# EAGLE design 30w developer board (EAGLE 5.07)
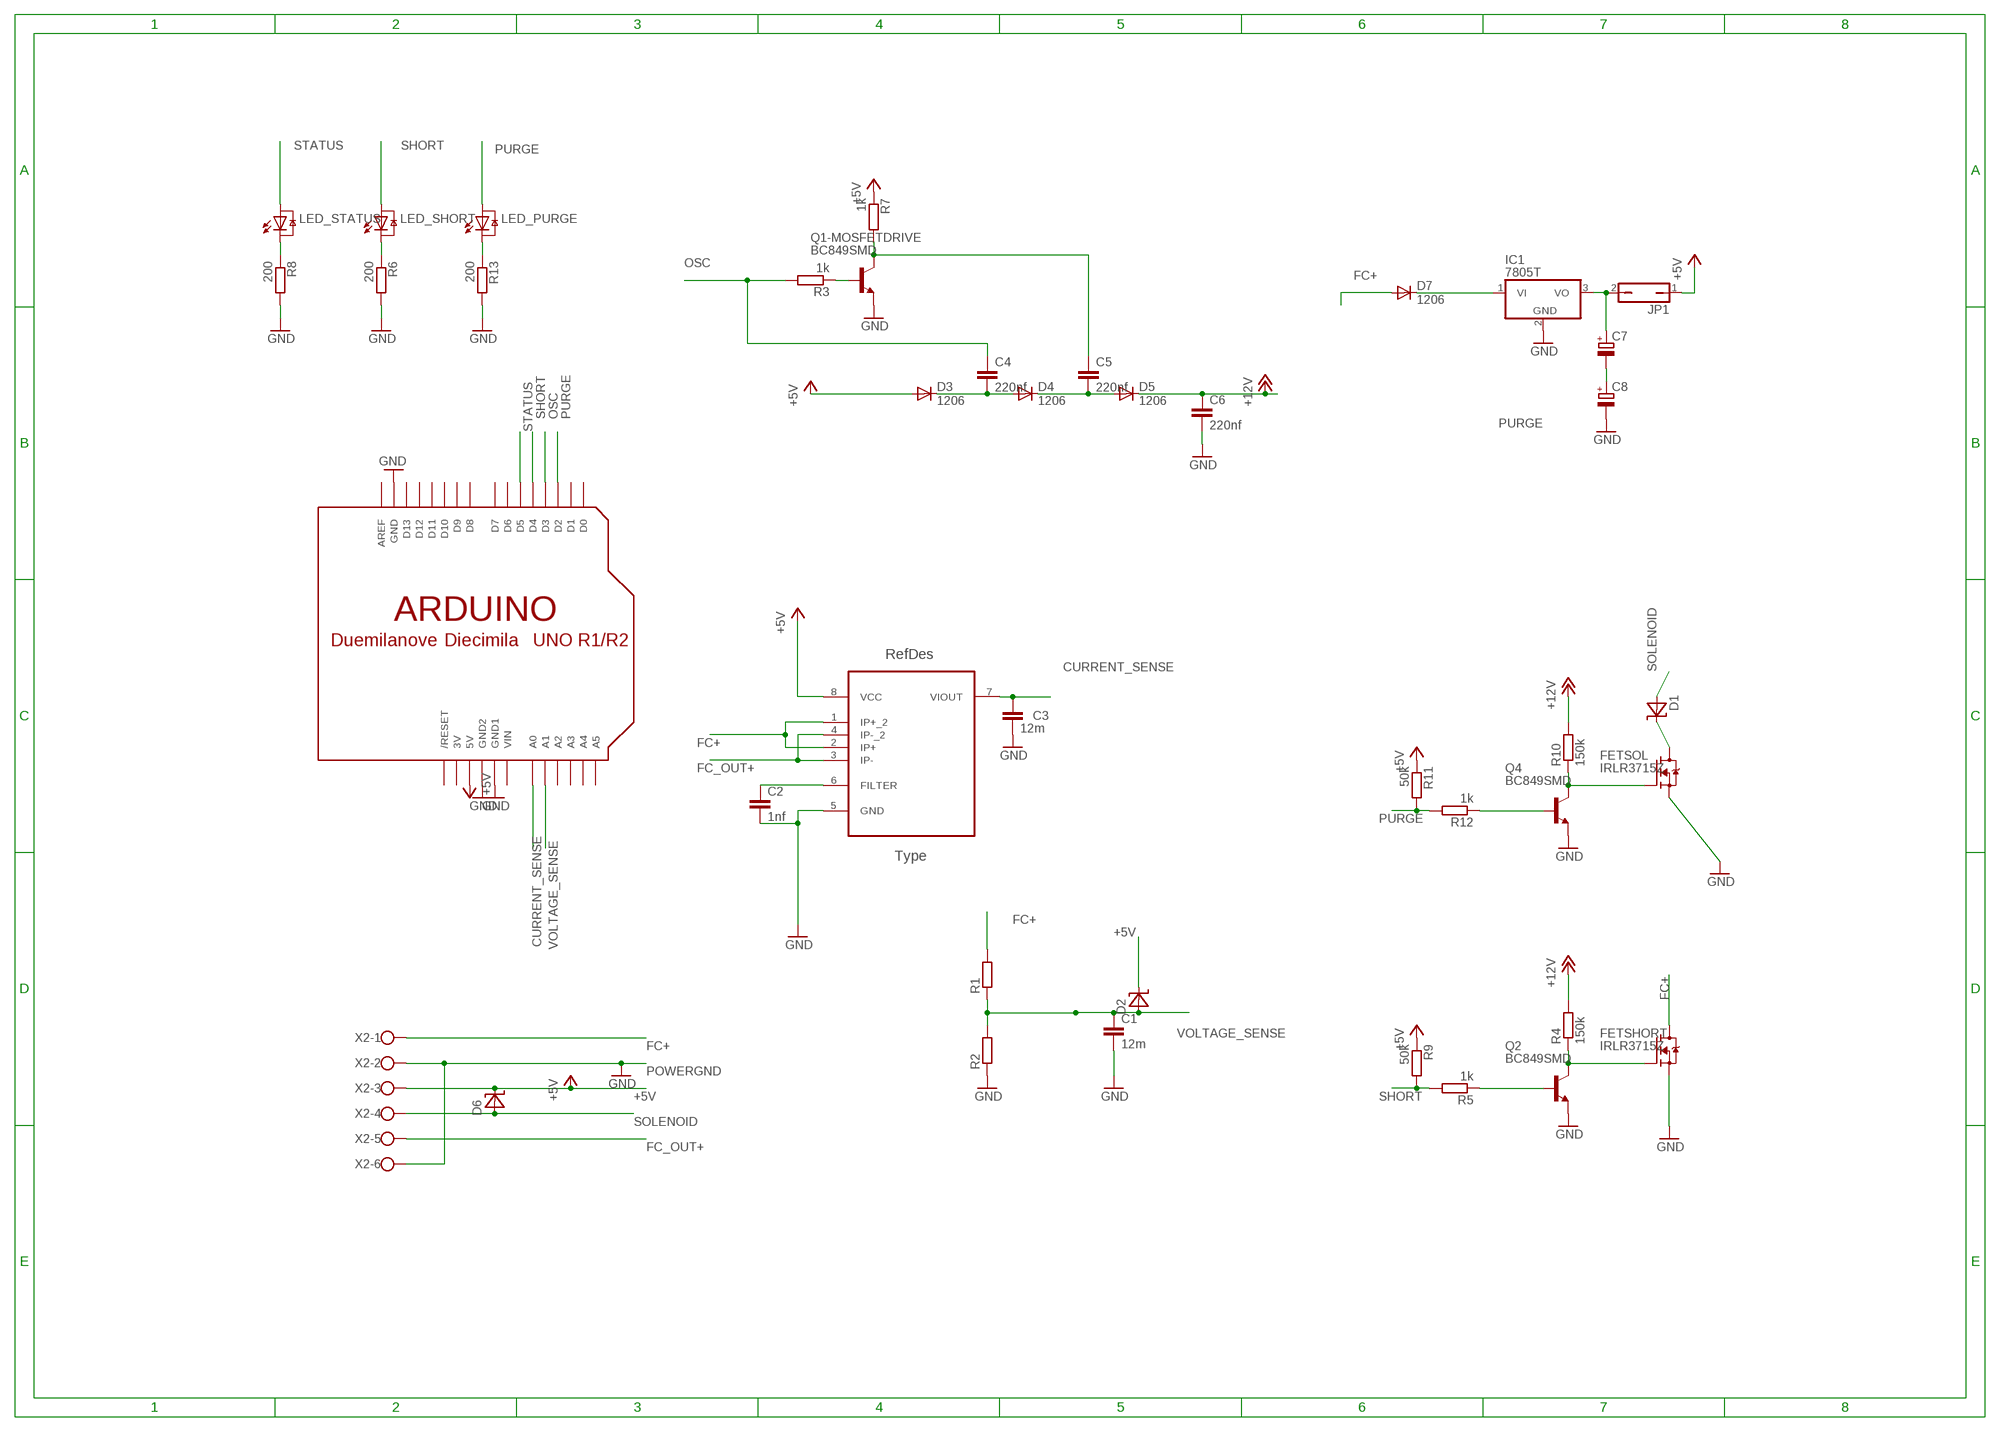
[diagram p0: schematic, sheet 1]

## Parts
C1  12m  C-EUC1206  [C1206]
C2  1nf  C-EUC1206  [C1206]
C3  12m  C-EUC1206  [C1206]
C4  220nf  C-EUC1206  [C1206]
C5  220nf  C-EUC1206  [C1206]
C6  220nf  C-EUC1206  [C1206]
C7  CPOL-EUE5-10.5  [E5-10,5]
C8  CPOL-EUE5-10.5  [E5-10,5]
D1  1206ZENER  [C1206]
D2  1206ZENER  [C1206]
D3  1206  [C1206]
D4  1206  [C1206]
D5  1206  [C1206]
D6  1206ZENER  [C1206]
D7  1206  [C1206]
FETSHORT  IRLR3715Z  [TO252]
FETSOL  IRLR3715Z  [TO252]
IC1  7805T  [TO220H]
JP1  JP1Q  [JP1]
LED_PURGE  GM5BW96385A  [GM5BW96385A]
LED_SHORT  GM5BW96385A  [GM5BW96385A]
LED_STATUS  GM5BW96385A  [GM5BW96385A]
Q1-MOSFETDRIVE  BC849SMD  [SOT23-BEC]
Q2  BC849SMD  [SOT23-BEC]
Q4  BC849SMD  [SOT23-BEC]
R1  R-EU_R1206  [R1206]
R2  R-EU_R1206  [R1206]
R3  1k  R-EU_M1206  [M1206]
R4  150k  R-EU_M1206  [M1206]
R5  1k  R-EU_M1206  [M1206]
R6  200  R-EU_M1206  [M1206]
R7  1k  R-EU_M1206  [M1206]
R8  200  R-EU_M1206  [M1206]
R9  50k  R-EU_M1206  [M1206]
R10  150k  R-EU_M1206  [M1206]
R11  50k  R-EU_M1206  [M1206]
R12  1k  R-EU_M1206  [M1206]
R13  200  R-EU_M1206  [M1206]
U1  ACS712ELCTR-05B-T  [SOIC127P600X175-8N]
U$1  ARDUINO-BPLACE  [ARDUINO-BPLACE]
X2  W237-6  [W237-6]

## Nets
+5V [medpower]: D2.CATHODE(C) D3.ANODE(A) D6.CATHODE(C) JP1.1 R7.1 R9.1 R11.1 U1.8(VCC) U$1.5V X2.3
+12V: C6.1 D5.CATHODE(C) R4.2 R10.2
CURRENT_SENSE: C3.1 U1.7(VIOUT) U$1.A0
FC+ [power]: D7.ANODE(A) FETSHORT.3(D) R1.2 U1.1(IP+_2) U1.2(IP+) X2.1
FC_OUT+ [power]: U1.3(IP-) U1.4(IP-_2) X2.5
GND [medpower]: C1.2 C2.2 C3.2 C6.2 C8.- IC1.2(GND) Q1-MOSFETDRIVE.E Q2.E Q4.E R2.1 R6.2 R8.2 R13.2 U1.5(GND) U$1.GND U$1.GND1 U$1.GND2
N$1: C7.+ IC1.3(VO) JP1.2
N$2: C7.- C8.+
N$3: FETSHORT.1(G) Q2.C R4.1
N$4: FETSOL.1(G) Q4.C R10.1
N$5: C2.1 U1.6(FILTER)
N$6: C4.2 D3.CATHODE(C) D4.ANODE(A)
N$7: C5.2 D4.CATHODE(C) D5.ANODE(A)
N$8: Q4.B R12.1
N$9: D7.CATHODE(C) IC1.1(VI)
N$10 [medpower]: D1.CATHODE(C) FETSOL.3(D)
N$11: C5.1 Q1-MOSFETDRIVE.C R7.2
N$12: Q1-MOSFETDRIVE.B R3.1
N$13: LED_SHORT.C R6.1
N$14: Q2.B R5.1
N$15: LED_PURGE.C R13.1
N$16: LED_STATUS.C R8.1
OSC: C4.1 R3.2 U$1.D3
POWERGND [power]: FETSHORT.2(S) FETSOL.2(S) X2.2 X2.6 ; supply symbol labelled GND
PURGE: LED_PURGE.A R11.2 R12.2 U$1.D2
SHORT: LED_SHORT.A R5.2 R9.2 U$1.D4
SOLENOID [medpower]: D1.ANODE(A) D6.ANODE(A) X2.4
STATUS: LED_STATUS.A U$1.D5
VOLTAGE_SENSE: C1.1 D2.ANODE(A) R1.1 R2.2 U$1.A1
Unconnected: U$1.A2 U$1.A3 U$1.A4 U$1.A5 U$1.AREF U$1.D0 U$1.D1 U$1.D6 U$1.D7 U$1.D8 U$1.D9 U$1.D10 U$1.D11 U$1.D12 U$1.D13 U$1.RESET(/RESET)

## Power pins joined to a net without a drawn wire
3V: U$1.3V
VIN: U$1.VIN

## Library data of the parts
C1-C3 = matt rcl:C-EU: CAPACITOR, European symbol
C4-C6 = resistor:C-EU: CAPACITOR, European symbol
C7 C8 = matt rcl:CPOL-EU: POLARIZED CAPACITOR, European symbol
D1 D2 D6 = matt diode:1206ZENER
D3-D5 D7 = matt diode:1206
FETSHORT FETSOL = matt transistor-fet:IRLR3715Z
IC1 = linear:78*: Positive VOLTAGE REGULATOR Source: http://cache.national.com/ds/LM/LM78L05.pdf http://www.fairchildsemi.com/ds/LM/LM7805.pdf
JP1 = jumper:JP1Q: JUMPER
LED_PURGE LED_SHORT LED_STATUS = matt led:GM5BW96385A: High brightness White Color LED 2300 mcd @ IF = 20mA achieved via InGaN Blue LED chip in combination with Yellow Phosphor Source: http://document.sharpsma.com/files/GM5BW96385A.pdf
Q1-MOSFETDRIVE Q2 Q4 = matt transistor-npn:BC849*: NPN Transistor
R1 R2 = matt rcl:R-EU_: RESISTOR, European symbol
R3-R13 = resistor:R-EU_: RESISTOR, European symbol
U1 = matt-allegro:ACS712ELCTR-05B-T: Linear Current Sensor; DESCRIPTION: Linear Current Sensor; MPN: ACS712ELCTR-05B-T; OC_FARNELL: 27M3644; OC_NEWARK: 1329623; PACKAGE: SOIC-8; SUPPLIER: Allegro
U$1 = adafruit:ARDUINO: Arduino Diecimila/Duemilanove Make a shield with ease, this package has all the named pins as well as the two mounting drill holes and an outline of the USB and DC power connector. The outline is on the DIMENSION layer, so if your board house uses it they will cut the outline to match. http://www.ladyada.net/library/pcb/eaglelibrary.html
X2 = con-wago-500:W237-6: WAGO SCREW CLAMP

## Net classes
1 power: width 3 mm
2 medpower: width 1 mm

## Board
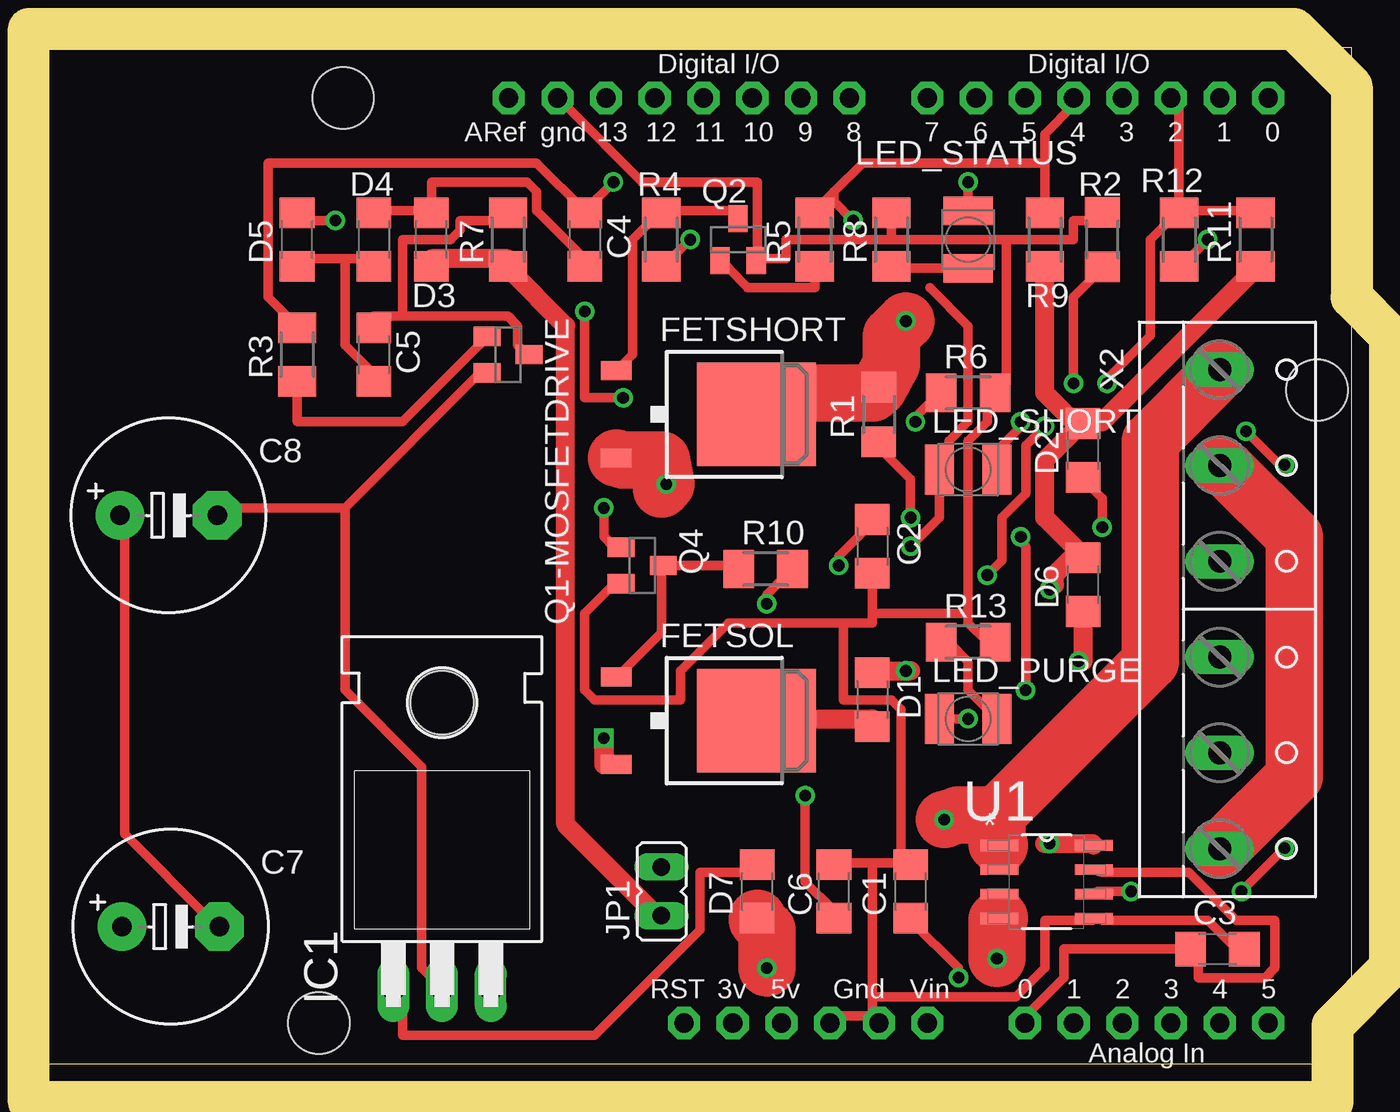
[diagram p1: board, top side]
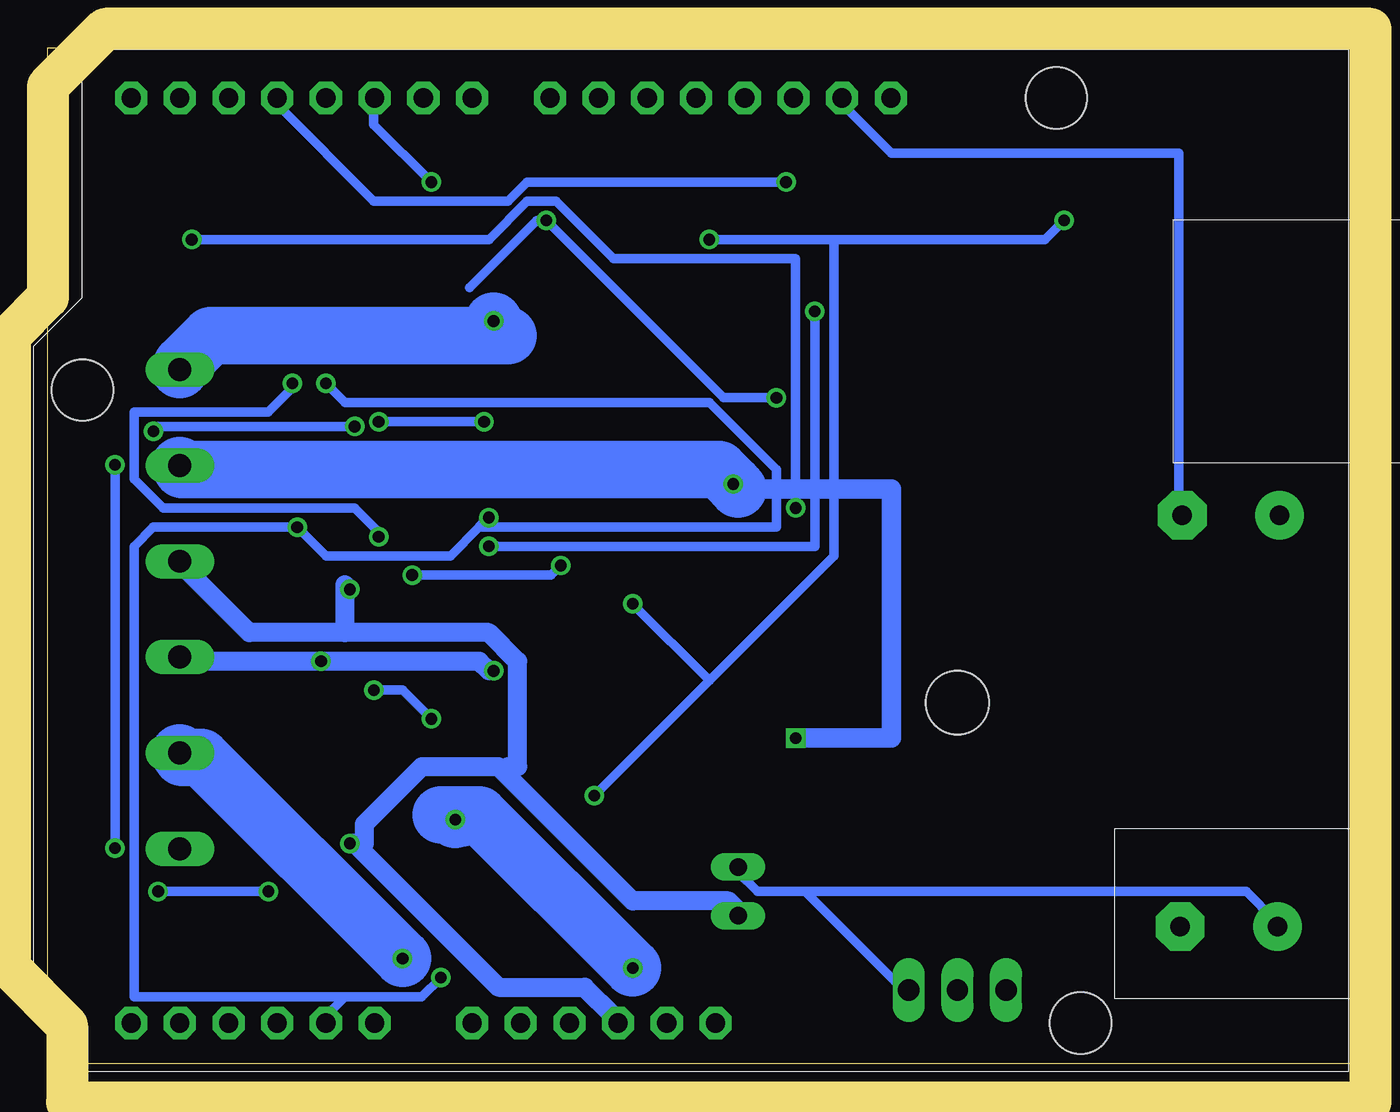
[diagram p2: board, bottom side, seen from below]

Size 68 x 53 mm. Coordinates in mm from the lower left corner, seen from the top.
Outline: 0,0 68,0 68,53 0,53 0,0
Copper layers (1*16): Top 0.035mm / dielectric 1.5mm / Bottom 0.035mm
Design rules "default *": minimum track width 0.5mm, minimum drill 24mil, track to track 8mil, track to pad 8mil, pad to pad 8mil, via to via 8mil, smd to smd 8mil, copper to edge 40mil, drill to drill 8mil, minimum pad ring 10mil, minimum via ring 8mil, stop-mask expansion 4mil, vias tented up to drill 0mil, thermal gap 10mil
Holes 0.6 mm at -3,-4 71,-4
Milling: 9 lines

### Footprints (pad centres in the part's own frame; a part is rotated, then mirrored left to right if it is on the bottom)
C1206 = smd 1.6 x 1.8: 1 -1.4,0; 2 1.4,0
E5-10,5 = drill 1.016 pad 2.54 round: + -2.54,0 | drill 1.016 pad 2.54 octagon: - 2.54,0
C1206' = smd 1.6 x 1.8: ANODE -1.4,0; CATHODE 1.4,0
TO252 = smd 1 x 1.6: 1 -2.28,-4.8; 2 2.28,-4.8 | smd 5.4 x 6.2: 3 0,2.5
TO220H = drill 1.118 long: 1 -2.54,-10.16; 2 0,-10.16; 3 2.54,-10.16 | hole 3.302: 0,4.826
JP1 = drill 0.914 long: 1 0,-1.27; 2 0,1.27
GM5BW96385A = smd 1.5 x 2.6: A -1.5,0; C 1.5,0
SOT23-BEC = smd 1 x 1.4: B -0.95,-1.1; C 0,1.1; E 0.95,-1.1
R1206 = smd 1.6 x 1.803: 1 -1.422,0; 2 1.422,0
M1206 = smd 1.6 x 2: 1 -1.4,0; 2 1.4,0
SOIC127P600X175-8N = smd 1.981 x 0.559: 1 -2.464,1.905; 2 -2.464,0.635; 3 -2.464,-0.635; 4 -2.464,-1.905; 5 2.464,-1.905; 6 2.464,-0.635; 7 2.464,0.635; 8 2.464,1.905
ARDUINO-BPLACE = drill 1 pad 1.676 octagon: 3V 35.56,2.54; 5V 38.1,2.54; A0 50.8,2.54; A1 53.34,2.54; A2 55.88,2.54; A3 58.42,2.54; A4 60.96,2.54; A5 63.5,2.54; AREF 23.876,50.8; D0 63.5,50.8; D1 60.96,50.8; D2 58.42,50.8; D3 55.88,50.8; D4 53.34,50.8; D5 50.8,50.8; D6 48.26,50.8; D7 45.72,50.8; D8 41.656,50.8; D9 39.116,50.8; D10 36.576,50.8; D11 34.036,50.8; D12 31.496,50.8; D13 28.956,50.8; GND 26.416,50.8; GND1 43.18,2.54; GND2 40.64,2.54; RESET 33.02,2.54; VIN 45.72,2.54 | hole 3.2: 15.24,50.8; 66.04,35.56; 13.97,2.54
W237-6 = drill 1.194 long: 1 -12.5,-1.27; 2 -7.5,-1.27; 3 -2.5,-1.27; 4 2.5,-1.27; 5 7.5,-1.27; 6 12.5,-1.27

### Placement (x,y rotation side)
C1  45,9 90 top
C2  43,27 270 top
C3  61,6 0 top
C4  28,43 270 top
C5  17,37 270 top
C6  41,9 90 top
C7  6.4,7.16 0 top
C8  6.29,28.62 0 top
D1  [C1206']  43,19 270 top
D2  [C1206']  54,32 90 top
D3  1206  [C1206']  20,43 90 top
D4  1206  [C1206']  17,43 270 top
D5  1206  [C1206']  13,43 90 top
D6  [C1206']  54,25 90 top
D7  1206  [C1206']  37,9 90 top
FETSHORT  34.45,33.88 270 top
FETSOL  34.45,17.91 270 top
IC1  20.56,14.02 0 top
JP1  32,9 0 top
LED_PURGE  48,18 0 top
LED_SHORT  48,31 0 top
LED_STATUS  48,43 270 top
Q1-MOSFETDRIVE  24,37 270 top
Q2  36,43 0 top
Q4  31,26 270 top
R1  43.34,33.88 90 top
R2  55,43 270 top
R3  13,37 90 top
R4  32,43 270 top
R5  40,43 90 top
R6  48,35 0 top
R7  24,43 90 top
R8  44,43 90 top
R9  52,43 90 top
R10  37.44,25.82 0 top
R11  63,43 90 top
R12  59,43 90 top
R13  48,22 0 top
U1  52.09,9.5 0 top
U$1  0.16,-0.41 0 top
X2  62.39,23.72 270 top

### Tracks (layer width: path | path; a pad name or v marks a point on that pad's centre or on a via)
+5V  (via drill 0.61)
  Top 1: D2.CATHODE 54,33.5 52,31.5 52,28.5 54,26.5 D6.CATHODE 53.5,26.5 52.5,25.5 52.5,25 v52.25,24.75 | R9.1 52,35 53.5,33.5 D2.CATHODE | R11.1 63,41.5 55,33.5 54.5,33.5 D2.CATHODE | D3.ANODE 20,42 24,42 R7.1 24,41.5 27,38.5 27,12.5 32,7.5 JP1.1 | 52,11.5 v52.25,11.5 54.5,11.5 U1.8
  Bottom 1: 52,11.5 44.5,4 40,4 38.5,2.5 U$1.5V | 44.25,15.25 44.5,15.5 48.5,15.5 51.5,12.5 51.5,11.5 52,11.5 | 44.25,15.25 37.5,8.5 32.5,8.5 32,8 JP1.1 | 52.5,22.5 45,22.5 43.5,21 43.5,15.5 44,15.5 44.25,15.25 | 52.5,22.5 57.5,22.5 61,26 X2.3 | 52.5,22.5 52.5,24.75 | 52.5,24.75 52.5,25 | 52,11.5 v52.25,11.5 | 52.5,24.75 v52.25,24.75
+12V  (via drill 0.61)
  Top 0.5: v15,44 13,44 D5.CATHODE | v33.5,43 32,41.5 R4.2 | v39.5,14 39.5,9.5 41,8 C6.1 | v37.5,24 37.5,24.5 38.5,25.5 R10.2
  Bottom 0.5: v15,44 16,43 27,43 | 27,43 v33.5,43 | 33.5,20 27,26.5 27,43 | v39.5,14 33.5,20 | 33.5,20 v37.5,24
CURRENT_SENSE
  Top 0.5: U$1.A0 51,2.5 53,4.5 53,6 C3.1 60,6 60,4.5 63.5,4.5 64,5 64,7.5 62,7.5 59.5,10 55,10 U1.7
FC+  (via drill 0.61)
  Top 0.406: U1.1 U1.2
  Top 3: FETSHORT.3 37,34 37,35 43,35 R1.2 44,36.5 44,38 v44.75,38.75 | v37.5,5 37.5,7 37,7.5 D7.ANODE | 49.5,13 47.5,13 v46.75,12.75 | 49.5,13 49.5,11.5 U1.1 | X2.1 61,36 57.5,32.5 57.5,21 49.5,13
  Bottom 3: v37.5,5 45.5,13 | 45.5,13 47.5,13 | 44.75,38 59.5,38 61,36.5 X2.1 | 44.75,38 44,38 | 45.5,13 v46.75,12.75 | 44.75,38 v44.75,38.75
FC_OUT+  (via drill 0.61)
  Top 0.406: U1.4 U1.3
  Top 3: v49.5,5.5 49.5,7.5 U1.4
  Bottom 3: v49.5,5.5 60,16 61,16 X2.5
GND
  Top 0.5: 15.5,29 22.5,36 Q1-MOSFETDRIVE.E | 15.5,29 9,29 C8.- | 15.5,29 15.5,19.5 19.5,15.5 19.5,5 20.5,4 IC1.2 | C3.2 62,6 60.5,7.5 55,7.5 U1.5 54.5,7.5 52,7.5 52,5 50.5,3.5 43,3.5 | 44.5,10.5 45,10.5 C1.2 44.5,10.5 | 44.5,10.5 43,10.5 | 43,10.5 41,10.5 C6.2 | 43,3.5 43,2.5 | 43,10.5 43,3.5 | 43,2.5 41,2.5 U$1.GND2 | 43,2.5 U$1.GND1 | 41.5,23 43,23 43,23.5 | 41.5,23 35.5,23 33,20.5 33,19 28.5,19 28,19.5 28,23.5 29.5,25 Q4.E | 43,23.5 C2.2 | 48,23.5 48,23 49,22 R13.2 | 48,23.5 43,23.5 | 37,42 38.5,42 38.5,43 44,43 | 44,43 R8.2 | 44,43 50,43 | 50,43 53.5,43 53.5,44 55,44 R2.1 | 50,43 50,35.5 49.5,35 R6.2 49,35 49,33.5 48,32.5 48,23.5 | 37,42 37,46 31,46 27,50 U$1.GND | 37,42 Q2.E | 44.5,10.5 44.5,18.5 44,19 41.5,19 41.5,23
  Bottom 0.5: C8.- 9,29 9,47.5 24,47.5 26.5,50 U$1.GND
N$1
  Bottom 0.5: 28.5,9 31,9 32,10 JP1.2 | 28.5,9 23.5,4 IC1.3 | 28.5,9 5.5,9 4,7.5 C7.+
N$2
  Top 0.5: C7.- 8.5,7.5 4,12 4,28.5 C8.+
N$3
  Top 0.5: 32,44.5 36,44.5 Q2.C | 32,44.5 30.5,43 30.5,37 30,36.5 FETSHORT.1 | 32,44.5 R4.1
N$4
  Top 0.5: R10.1 36,26 Q4.C 32,26 32,22.5 30,20.5 FETSOL.1
N$5  (via drill 0.61)
  Top 0.5: v41.25,26 41.25,26.5 43,28.25 C2.1 | v49,25.5 49.75,26.25 49.75,28.5 51,29.75 51,32.25 v52,33.25 | v62.5,33 64.25,31.25 v64.5,31.25 | v62.25,9 v64.5,11.25 | v56.5,9 54.75,9 U1.6
  Bottom 0.5: v41.25,26 41.75,25.5 v49,25.5 | v52,33.25 62.25,33.25 v62.5,33 | v64.5,11.25 v64.5,31.25 | v56.5,9 v62.25,9
N$6
  Top 0.5: 20,44.5 17,44.5 D4.ANODE | 20,44.5 20,46 25,46 25.5,45.5 25.5,44.5 28,42 C4.2 | 20,44.5 D3.CATHODE
N$7
  Top 0.5: 15.5,42 17,42 D4.CATHODE | 15.5,42 13,42 D5.ANODE | 15.5,42 15.5,37.5 17,36 C5.2
N$8  (via drill 0.61)
  Top 0.5: v29,29 29,27.5 29.5,27 Q4.B | v60.5,43 59,41.5 R12.1
  Bottom 0.5: v29,29 29,42 38.5,42 41.5,45 43,45 45,43 v60.5,43
N$9
  Top 0.5: D7.CATHODE 37,10 34,10 34,7 28.5,1.5 18.5,1.5 18.5,3.5 IC1.1
N$10
  Top 1: D1.CATHODE 43,18 37,18 FETSOL.3
N$11
  Top 0.5: 18.5,39 17,39 C5.1 | 18.5,39 24,39 24.5,38.5 24.5,37.5 25,37 Q1-MOSFETDRIVE.C | 18.5,39 18.5,43 21,43 21.5,43.5 21.5,44 24,44 R7.2
N$12
  Top 0.5: Q1-MOSFETDRIVE.B 22.5,37.5 18.5,33.5 13,33.5 R3.1
N$13  (via drill 0.61)
  Top 0.5: 45.12,33.62 45,33.5 | 45.12,33.62 46.5,35 R6.1 | 50.88,33.38 49.5,32 LED_SHORT.C | 50.88,33.38 51,33.5 | v45.25,33.5 45.12,33.62 | v50.75,33.5 50.88,33.38
  Bottom 0.5: 45,33.5 v45.25,33.5 v50.75,33.5 51,33.5
N$14
  Top 0.5: Q2.B 35.5,41.5 36.5,40.5 40,40.5 R5.1
N$15
  Top 0.5: LED_PURGE.C 48,19.5 48,21 47,22 R13.1
N$16
  Top 0.5: LED_STATUS.C 44,41.5 R8.1
OSC  (via drill 0.61)
  Top 0.5: 28,44.5 25.5,47 11.5,47 11.5,40 13,38.5 R3.2 | 28,44.5 v29.5,46 | 28,44.5 C4.1
  Bottom 0.5: v29.5,46 43,46 44,45 51,45 56,50 U$1.D3
POWERGND  (via drill 0.6 pad 1.02, 0.61)
  Top 1.016: FETSOL.2 29,15.63 v29,17
  Top 3: 32,31.5 30,31.5 FETSHORT.2 | 32,31.5 32,30 | X2.6 61.5,11.5 65,15 65,27.5 61.5,31 X2.2 | v32.25,30.25 32,31.5
  Bottom 1.016: v29,17 24,17 24,30 32.25,30 v32.25,30.25
  Bottom 3: 32,30 v32.25,30.25 33,31 61,31 X2.2
PURGE  (via drill 0.61)
  Top 0.5: 59,44.5 63,44.5 R11.2 | LED_PURGE.A v48,18 | v51,19.5 51,27 50.62,27.38 | 50.62,27.38 50.5,27.5 | 55.12,35.62 55,35.5 | 55.12,35.62 57.5,38 57.5,43 59,44.5 | 59,44.5 59,50 U$1.D2 | 59,44.5 R12.2 | 50.62,27.38 v50.75,27.5 | v55.25,35.5 55.12,35.62
  Bottom 0.5: v48,18 49.5,19.5 v51,19.5 | 50.62,27.62 50.5,27.5 | 50.62,27.62 52,29 62,29 63.5,30.5 63.5,34 56.5,34 55.12,35.38 | 55.12,35.38 55,35.5 | v50.75,27.5 50.62,27.62 | 55.12,35.38 v55.25,35.5
SHORT  (via drill 0.61)
  Top 0.5: 41,45.5 42.5,47 52,47 | 41,45.5 40,44.5 R5.2 | 52,47 R9.2 | 46,40.5 48,38.5 48,33.5 47,32.5 47,31.5 LED_SHORT.A 46.5,28.5 v45,27 | v42,44 41,45 41,45.5 | 52,47 52,48.5 53.5,50 U$1.D4 | v30,34.75 28,34.75 v28,39.25
  Bottom 0.5: 46,40.5 42.5,44 v42,44 32.75,34.75 v30,34.75 | v28,39.25 28,27 v45,27
SOLENOID  (via drill 0.61)
  Top 1: 45,20.5 v44.75,20.5 43,20.5 D1.ANODE | D6.ANODE 54,21 v53.75,21
  Bottom 1: X2.4 61,21 v53.75,21 45.5,21 45,20.5 v44.75,20.5
STATUS  (via drill 0.61)
  Top 0.5: LED_STATUS.A v48,46
  Bottom 0.5: v48,46 51,49 51,50 U$1.D5
VOLTAGE_SENSE  (via drill 0.61)
  Top 0.5: v47.5,4.5 47.5,5 45,7.5 C1.1 | v55,28 55,29.5 54,30.5 D2.ANODE | v45,28.5 45,30.5 43.5,32 R1.1 | v53.5,35.5 53.5,40 55,41.5 R2.2
  Bottom 0.5: v47.5,4.5 48.5,3.5 52.5,3.5 | 52.5,3.5 53.5,2.5 U$1.A1 | 52.5,3.5 63.5,3.5 63.5,27 62.5,28 v55,28 53.5,26.5 47,26.5 45.5,28 | 45.5,28 v45,28.5 | v53.5,35.5 52.5,34.5 33.5,34.5 30,31 30,28 45.5,28